# EAGLE design ESP32 VERSION 2 (EAGLE 9.1.3)
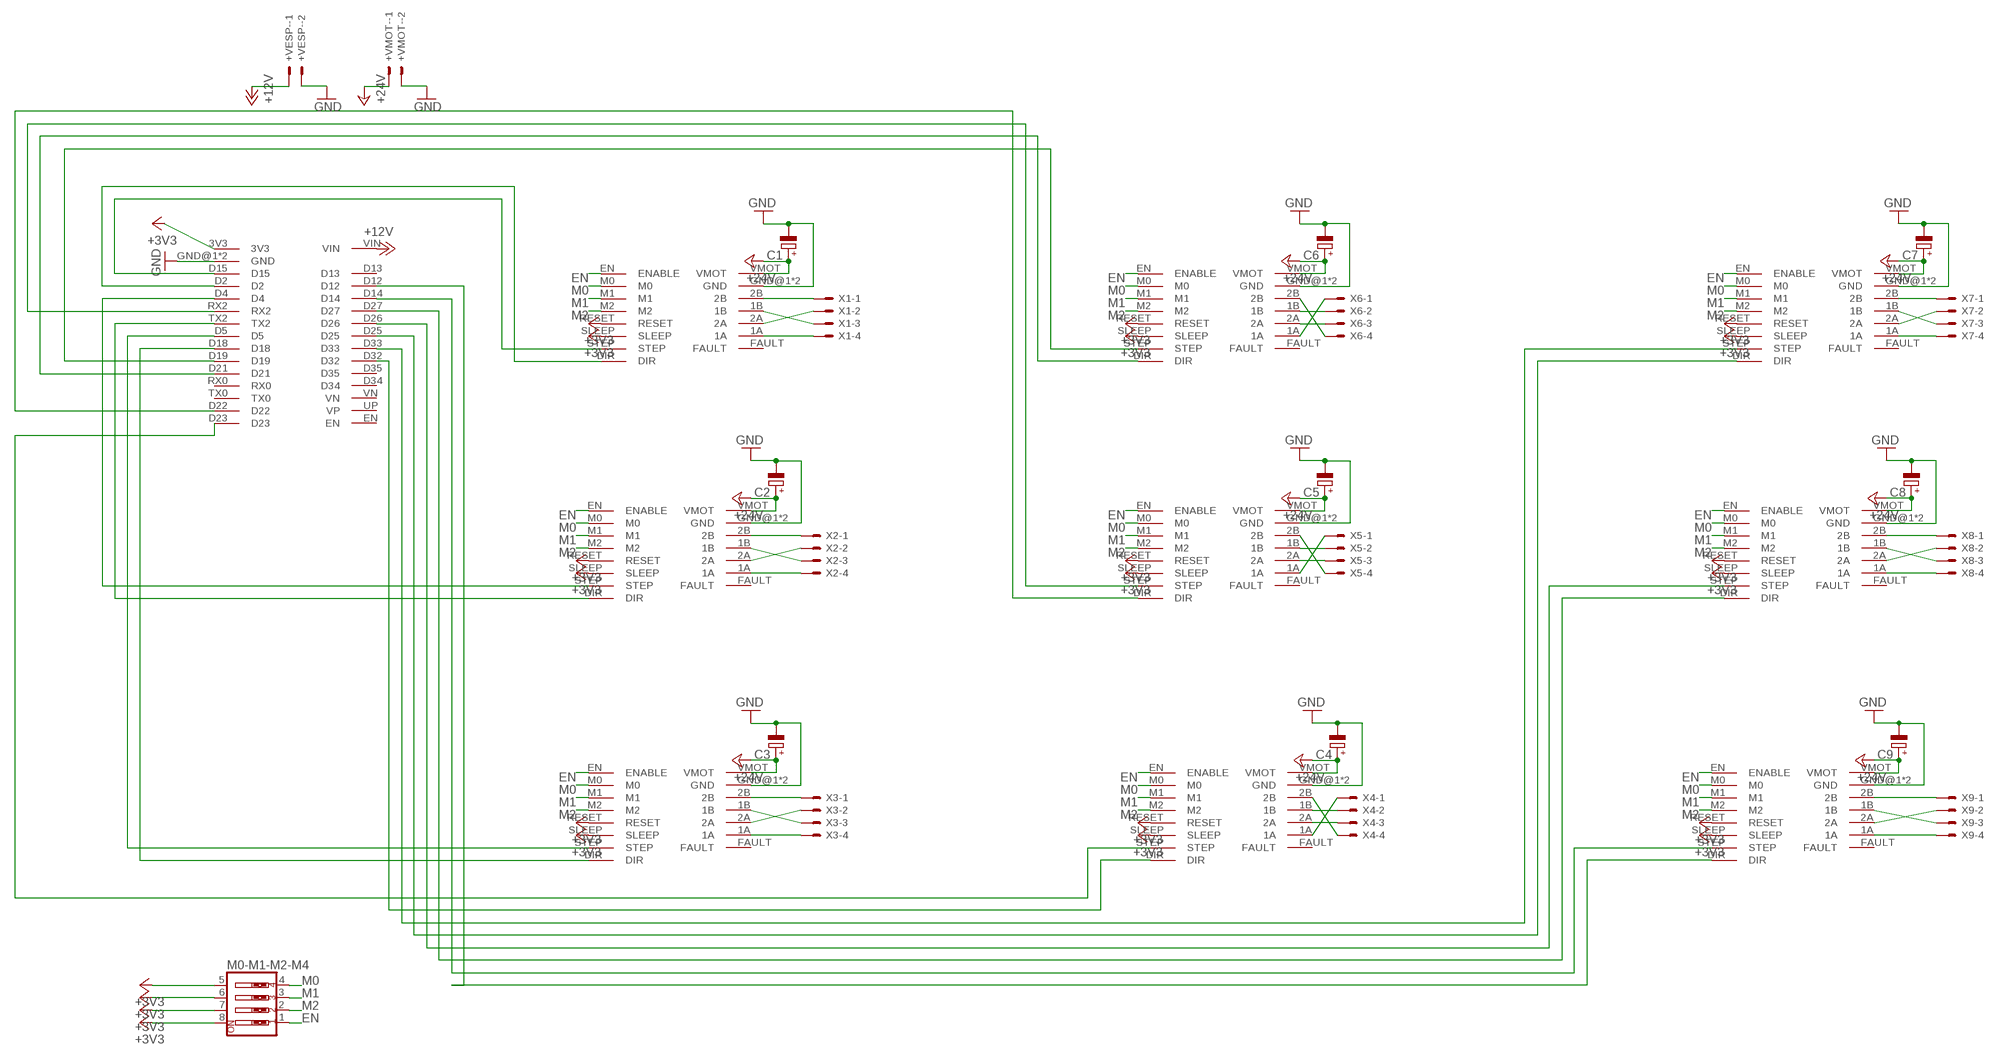
[diagram p0: schematic, sheet 1]

## Parts
+VESP-  22-23-2021  [22-23-2021]
+VMOT-  22-23-2021  [22-23-2021]
C1  CPOL-EUE3.5-8  [E3,5-8]
C2  CPOL-EUE3.5-8  [E3,5-8]
C3  CPOL-EUE3.5-8  [E3,5-8]
C4  CPOL-EUE3.5-8  [E3,5-8]
C5  CPOL-EUE3.5-8  [E3,5-8]
C6  CPOL-EUE3.5-8  [E3,5-8]
C7  CPOL-EUE3.5-8  [E3,5-8]
C8  CPOL-EUE3.5-8  [E3,5-8]
C9  CPOL-EUE3.5-8  [E3,5-8]
M0-M1-M2-M4  SW_DIP-4  [EDG-04]
U$1  DRV8825  [DRV8825]
U$2  DRV8825  [DRV8825]
U$3  STEPPER 0  DRV8825  [DRV8825]
U$4  DRV8825  [DRV8825]
U$5  DRV8825  [DRV8825]
U$6  DRV8825  [DRV8825]
U$7  DRV8825  [DRV8825]
U$8  DRV8825  [DRV8825]
U$9  DRV8825  [DRV8825]
U$10  ESP32  [ESP32]
X1  22-23-2041  [22-23-2041]
X2  22-23-2041  [22-23-2041]
X3  22-23-2041  [22-23-2041]
X4  22-23-2041  [22-23-2041]
X5  22-23-2041  [22-23-2041]
X6  22-23-2041  [22-23-2041]
X7  22-23-2041  [22-23-2041]
X8  22-23-2041  [22-23-2041]
X9  22-23-2041  [22-23-2041]

## Nets
+3V3: M0-M1-M2-M4.5 M0-M1-M2-M4.6 M0-M1-M2-M4.7 M0-M1-M2-M4.8 U$1.RESET U$1.SLEEP U$2.RESET U$2.SLEEP U$3.RESET U$3.SLEEP U$4.RESET U$4.SLEEP U$5.RESET U$5.SLEEP U$6.RESET U$6.SLEEP U$7.RESET U$7.SLEEP U$8.RESET U$8.SLEEP U$9.RESET U$9.SLEEP U$10.3V3
+12V: +VESP-.1 U$10.VIN
+24V: +VMOT-.1 C1.+ C2.+ C3.+ C4.+ C5.+ C6.+ C7.+ C8.+ C9.+ U$1.VMOT U$2.VMOT U$3.VMOT U$4.VMOT U$5.VMOT U$6.VMOT U$7.VMOT U$8.VMOT U$9.VMOT
EN [SIGNAL]: M0-M1-M2-M4.1 U$1.EN(ENABLE) U$2.EN(ENABLE) U$3.EN(ENABLE) U$4.EN(ENABLE) U$5.EN(ENABLE) U$6.EN(ENABLE) U$7.EN(ENABLE) U$8.EN(ENABLE) U$9.EN(ENABLE)
GND: +VESP-.2 +VMOT-.2 C1.- C2.- C3.- C4.- C5.- C6.- C7.- C8.- C9.- U$1.GND@1(GND) U$1.GND@2(GND) U$2.GND@1(GND) U$2.GND@2(GND) U$3.GND@1(GND) U$3.GND@2(GND) U$4.GND@1(GND) U$4.GND@2(GND) U$5.GND@1(GND) U$5.GND@2(GND) U$6.GND@1(GND) U$6.GND@2(GND) U$7.GND@1(GND) U$7.GND@2(GND) U$8.GND@1(GND) U$8.GND@2(GND) U$9.GND@1(GND) U$9.GND@2(GND) U$10.GND@1(GND) U$10.GND@2(GND)
M0 [SIGNAL]: M0-M1-M2-M4.4 U$1.M0 U$2.M0 U$3.M0 U$4.M0 U$5.M0 U$6.M0 U$7.M0 U$8.M0 U$9.M0
M1 [SIGNAL]: M0-M1-M2-M4.3 U$1.M1 U$2.M1 U$3.M1 U$4.M1 U$5.M1 U$6.M1 U$7.M1 U$8.M1 U$9.M1
M2 [SIGNAL]: M0-M1-M2-M4.2 U$1.M2 U$2.M2 U$3.M2 U$4.M2 U$5.M2 U$6.M2 U$7.M2 U$8.M2 U$9.M2
N$1: U$3.2B X1.1
N$2: U$9.1B X9.3
N$3: U$9.2A X9.2
N$4: U$3.1A X1.4
N$5 [SIGNAL]: U$3.STEP U$10.D15
N$6 [SIGNAL]: U$3.DIR U$10.D2
N$7: U$4.1A X6.1
N$8: U$4.2A X6.3
N$9: U$4.1B X6.2
N$10: U$4.2B X6.4
N$11 [SIGNAL]: U$2.STEP U$10.D4
N$12 [SIGNAL]: U$2.DIR U$10.TX2
N$13: U$7.2B X7.1
N$14: U$7.2A X7.2
N$15: U$7.1B X7.3
N$16: U$7.1A X7.4
N$17 [SIGNAL]: U$1.STEP U$10.D5
N$18: U$2.2B X2.1
N$19: U$8.2B X8.1
N$20: U$8.1B X8.3
N$21: U$8.2A X8.2
N$22: U$8.1A X8.4
N$23 [SIGNAL]: U$1.DIR U$10.D18
N$24: U$2.1B X2.3
N$25: U$9.2B X9.1
N$26: U$5.1B X5.2
N$27: U$5.2A X5.3
N$28: U$9.1A X9.4
N$29 [SIGNAL]: U$4.DIR U$10.D21
N$30: U$2.2A X2.2
N$31: U$5.1A X5.1
N$32: U$5.2B X5.4
N$33: U$6.1B X4.2
N$34: U$6.2A X4.3
N$35 [SIGNAL]: U$4.STEP U$10.D19
N$36 [SIGNAL]: U$5.STEP U$10.RX2
N$37: U$6.2B X4.4
N$38: U$6.1A X4.1
N$39: U$1.1B X3.3
N$40: U$1.2A X3.2
N$41 [SIGNAL]: U$5.DIR U$10.D22
N$42: U$2.1A X2.4
N$43: U$1.2B X3.1
N$44: U$3.1B X1.3
N$45: U$3.2A X1.2
N$46: U$1.1A X3.4
N$47 [SIGNAL]: U$6.STEP U$10.D23
N$48 [SIGNAL]: U$6.DIR U$10.D32
N$49 [SIGNAL]: U$7.STEP U$10.D33
N$50 [SIGNAL]: U$7.DIR U$10.D25
N$51: U$8.STEP U$10.D26
N$52 [SIGNAL]: U$8.DIR U$10.D27
N$53 [SIGNAL]: U$9.STEP U$10.D14
N$54 [SIGNAL]: U$9.DIR U$10.D12
Unconnected: U$1.FAULT U$2.FAULT U$3.FAULT U$4.FAULT U$5.FAULT U$6.FAULT U$7.FAULT U$8.FAULT U$9.FAULT U$10.D13 U$10.D34 U$10.D35 U$10.EN U$10.RX0 U$10.TX0 U$10.UP(VP) U$10.VN

## Library data of the parts
+VESP- +VMOT- = con-molex:22-23-2021: .100" (2.54mm) Center Header - 2 Pin; MF: MOLEX; MPN: 22-23-2021; OC_FARNELL: 1462926; OC_NEWARK: 25C3832
C1-C9 = resistor:CPOL-EU: POLARIZED CAPACITOR, European symbol
M0-M1-M2-M4 = special:SW_DIP-4: DIP SWITCH
U$1-U$9 = DRV8825:DRV8825
U$10 = ESP32:ESP32
X1-X9 = con-molex:22-23-2041: .100" (2.54mm) Center Header - 4 Pin; MF: MOLEX; MPN: 22-23-2041; OC_FARNELL: 1462920; OC_NEWARK: 38C0355

## Net classes
0 POWER: width 0.305 mm, clearance 0.152 mm
1 SIGNAL: width 0.152 mm, clearance 0.152 mm

## Board
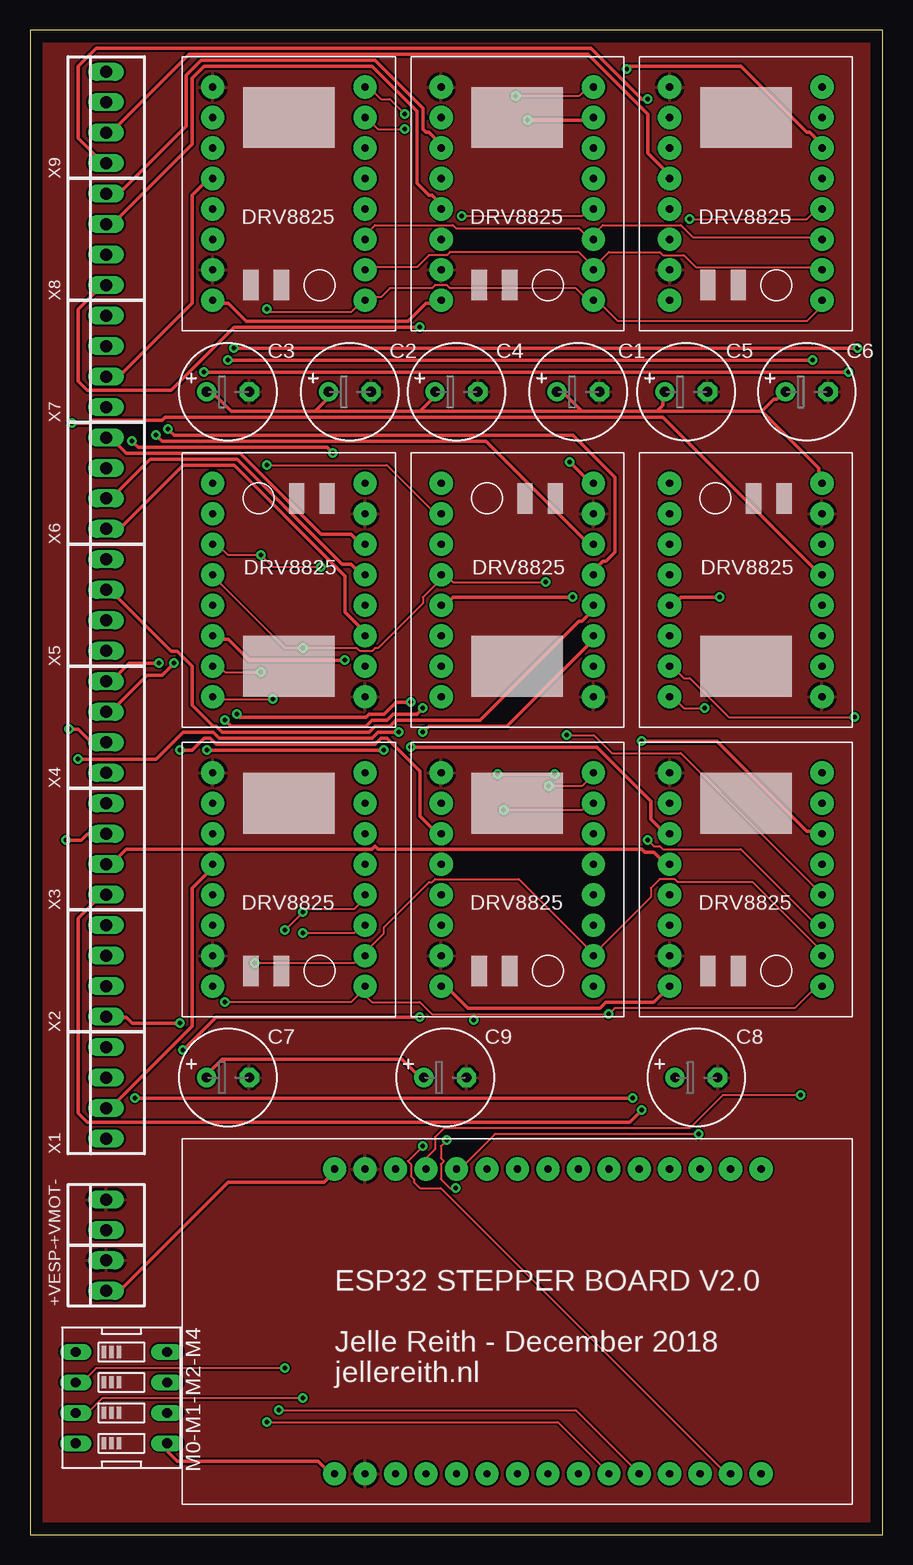
[diagram p1: board, top side]
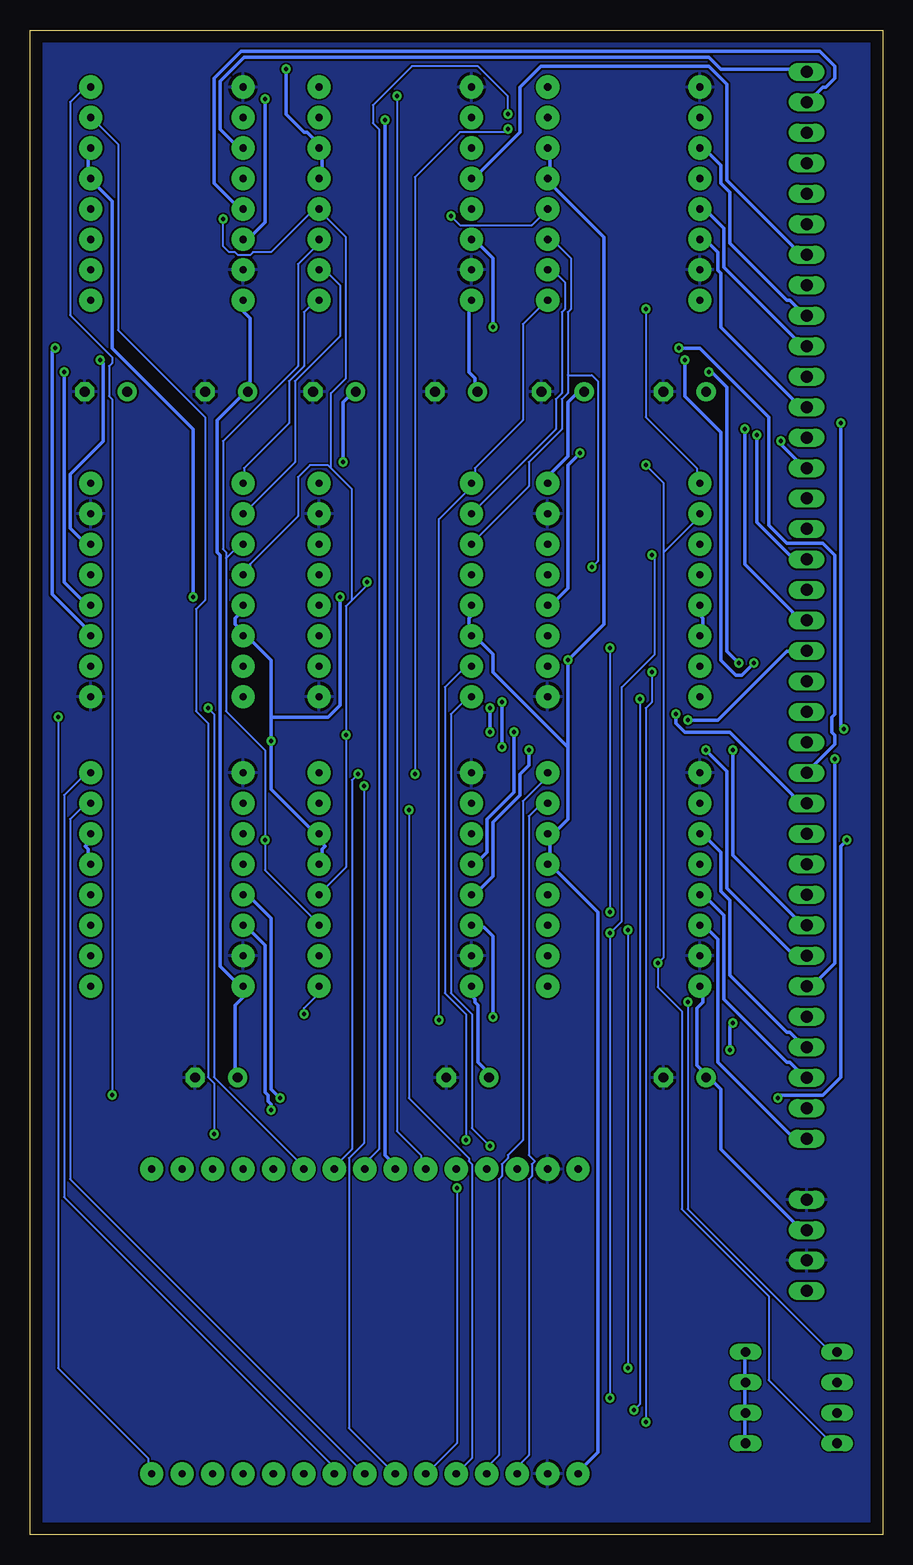
[diagram p2: board, bottom side, seen from below]

Size 71.1 x 125.4 mm. Coordinates in mm from the lower left corner, seen from the top.
Outline: 0,0 71.1,0 71.1,125.4 0,125.4 0,0
Copper layers (1*16): Top 0.035mm / dielectric 1.5mm / Bottom 0.035mm
Design rules "default *": minimum track width 6mil, minimum drill 0.35mm, track to track 6mil, track to pad 6mil, pad to pad 6mil, via to via 12mil, smd to smd 6mil, copper to edge 40mil, drill to drill 6mil, minimum pad ring 10mil, minimum via ring 8mil, stop-mask expansion 4mil, vias tented up to drill 0mil, thermal gap 10mil

### Footprints (pad centres in the part's own frame; a part is rotated, then mirrored left to right if it is on the bottom)
22-23-2021 = drill 1 long: 1 -1.27,0; 2 1.27,0
E3,5-8 = drill 0.813 pad 1.6: + -1.778,0 | drill 0.813 pad 1.6 octagon: - 1.778,0
EDG-04 = drill 0.813 long: 1 -3.81,-3.81; 2 -1.27,-3.81; 3 1.27,-3.81; 4 3.81,-3.81; 5 3.81,3.81; 6 1.27,3.81; 7 -1.27,3.81; 8 -3.81,3.81
DRV8825 = drill 0.6 pad 1.93: 1A 12.7,0; 1B 7.62,0; 2A 10.16,0; 2B 5.08,0; DIR 17.78,-12.7; EN 0,-12.7; FAULT 15.24,0; GND@1 17.78,0; GND@2 2.54,0; M0 2.54,-12.7; M1 5.08,-12.7; M2 7.62,-12.7; RESET 10.16,-12.7; SLEEP 12.7,-12.7; STEP 15.24,-12.7; VMOT 0,0
ESP32 = drill 0.6 pad 1.93: 3V3 0,-25.4; D2 7.62,-25.4; D4 10.16,-25.4; D5 17.78,-25.4; D12 7.62,0; D13 5.08,0; D14 10.16,0; D15 5.08,-25.4; D18 20.32,-25.4; D19 22.86,-25.4; D21 25.4,-25.4; D22 33.02,-25.4; D23 35.56,-25.4; D25 17.78,0; D26 15.24,0; D27 12.7,0; D32 22.86,0; D33 20.32,0; D34 27.94,0; D35 25.4,0; EN 35.56,0; GND@1 2.54,0; GND@2 2.54,-25.4; RX0 27.94,-25.4; RX2 12.7,-25.4; TX0 30.48,-25.4; TX2 15.24,-25.4; UP 33.02,0; VIN 0,0; VN 30.48,0
22-23-2041 = drill 1 long: 1 -3.81,0; 2 -1.27,0; 3 1.27,0; 4 3.81,0

### Placement (x,y rotation side)
+VESP-  6.35,21.59 90 top
+VMOT-  6.35,26.67 90 top
C1  45.72,95.25 0 top
C2  26.67,95.25 0 top
C3  16.51,95.25 0 top
C4  35.56,95.25 0 top
C5  54.72,95.25 0 top
C6  64.77,95.25 0 top
C7  16.51,38.1 0 top
C8  55.56,38.1 0 top
C9  34.61,38.1 0 top
M0-M1-M2-M4  7.62,11.43 270 top
U$1  53.34,45.72 90 top
U$2  34.29,45.72 90 top
U$3  15.24,45.72 90 top
U$4  27.94,87.63 270 top
U$5  46.99,87.63 270 top
U$6  66.04,87.63 270 top
U$7  15.24,102.87 90 top
U$8  34.29,102.87 90 top
U$9  53.34,102.87 90 top
U$10  25.4,30.48 0 top
X1  6.35,36.83 90 top
X2  6.35,46.99 90 top
X3  6.35,57.15 90 top
X4  6.35,67.31 90 top
X5  6.35,77.47 90 top
X6  6.35,87.63 90 top
X7  6.35,97.79 90 top
X8  6.35,107.95 90 top
X9  6.35,118.11 90 top

### Tracks (layer width: path | path; a pad name or v marks a point on that pad's centre or on a via)
+3V3  (via drill 0.35)
  Top 0.305: v49.75,122.15 50,122.4 59.25,122.4 64.75,116.9 65,116.9 66.25,115.65 U$9.SLEEP | v51,66.15 57.25,66.15 64.75,58.65 66,58.65 U$1.SLEEP | v57.5,78.15 54.25,78.15 53.75,77.65 53.5,77.65 U$6.RESET | U$10.3V3 25.25,5.15 25,5.4 24.75,5.4 24,6.15 12.25,6.15 11.5,6.9 11.5,7.4 M0-M1-M2-M4.5 | v26.25,72.9 18.25,72.9 16.5,74.65 15.5,74.65 15.25,74.9 U$4.SLEEP | v45.25,78.15 35.25,78.15 34.75,77.65 34.5,77.65 U$5.RESET
  Bottom 0.305: U$8.RESET 46.75,113.15 46.75,115.4 U$8.SLEEP 47,115.65 47.5,116.15 47.5,116.4 48,116.9 48.25,116.9 49.75,118.4 v49.75,122.15 | U$9.SLEEP 66.25,115.4 66.25,113.15 U$9.RESET 66,112.9 64.25,111.15 64.25,98.9 57.5,92.15 v57.5,78.15 | U$1.RESET 66.25,55.9 66.25,57.15 66.5,57.4 66.25,57.65 66.25,58.4 U$1.SLEEP | U$2.RESET 46.75,55.9 46.75,57.15 46.5,57.4 46.75,57.65 46.75,58.4 U$2.SLEEP 47,58.65 47.75,58.65 47.75,58.9 51,62.15 v51,66.15 51,68.15 | U$6.RESET 53.5,77.4 53.5,76.9 54,76.4 54,75.9 53.75,75.65 53.75,75.4 53.5,75.15 U$6.SLEEP 53.25,75.15 51,72.9 51,68.15 | M0-M1-M2-M4.5 11.5,7.65 11.5,10.15 M0-M1-M2-M4.6 11.5,10.4 11.5,12.65 M0-M1-M2-M4.7 11.5,12.9 11.5,15.15 M0-M1-M2-M4.8 | U$7.SLEEP 27.75,115.4 27.75,113.15 U$7.RESET 27.75,112.9 27.5,112.65 27.5,112.4 23.25,108.15 23.25,75.9 v26.25,72.9 26.25,65.65 | U$4.SLEEP 15,75.15 15,76.4 15.25,76.65 15.25,77.4 U$4.RESET | 27.75,55.9 27.75,58.4 U$3.SLEEP 27.75,58.65 27.25,58.65 26.25,59.65 26.25,65.65 | 27.75,55.9 U$3.RESET 27.75,55.9 | U$5.RESET 34.25,77.4 34.25,76.65 34.5,76.4 34.5,75.15 U$5.SLEEP 34.25,75.15 32.5,73.4 32.5,71.9 26.25,65.65 | 27.75,55.9 23.75,51.9 23.75,6.9 25,5.65 25,5.4 25.25,5.15 U$10.3V3 | 51,68.15 46.25,68.15 45.25,69.15 v45.25,78.15
+12V
  Top 0.305: +VESP-.1 6.5,20.4 6.75,20.65 7.75,20.65 16.5,29.4 24.5,29.4 25.5,30.4 U$10.VIN
+24V  (via drill 0.35)
  Top 0.305: U$1.VMOT 53.25,45.65 52,44.4 48,44.4 47.5,43.9 36.5,43.9 34.75,45.65 34.5,45.65 U$2.VMOT | C9.+ 32.75,38.15 32.5,38.4 32.25,38.4 31,39.65 16,39.65 14.5,38.15 C7.+ | 23.75,93.65 16.75,93.65 15.5,94.9 15,94.9 14.75,95.15 C3.+ | 23.75,93.65 24.75,94.65 24.75,95.15 C2.+ | U$7.VMOT 15.25,102.65 16.5,102.65 18,101.15 31.5,101.15 33,102.65 34.25,102.65 U$8.VMOT | 32.5,93.65 23.75,93.65 | 32.5,93.65 34,95.15 C4.+ | 46,93.65 44.5,95.15 44,95.15 C1.+ | 52.25,93.65 46,93.65 | 52.25,93.65 52.75,94.15 52.75,95.15 C5.+ | 61,93.65 62,94.65 62.25,94.65 62.75,95.15 C6.+ | 52.25,93.65 61,93.65 | v45,89.4 46.75,87.65 U$5.VMOT | 61,93.65 65.75,88.9 65.75,88.65 66,88.4 66,87.65 U$6.VMOT | 46,93.65 32.5,93.65
  Bottom 0.305: C8.+ 54,38.15 54,44.15 53.25,44.9 53.25,45.65 U$1.VMOT 53.5,45.9 54,45.9 54,46.15 55.25,47.4 55.25,81.65 55.5,81.9 55.5,92.9 53,95.4 | C9.+ 33,38.15 33,38.65 33.75,39.4 33.75,44.15 34,44.4 34,44.65 34.25,44.9 34.25,45.65 U$2.VMOT | +VMOT-.1 6.5,25.4 7,25.9 7.25,25.9 13.5,32.15 13.5,37.15 14.5,38.15 C7.+ 14.75,38.15 14.75,38.4 15.5,39.15 15.5,43.9 15,44.4 15,45.65 U$3.VMOT | U$4.VMOT 27.75,87.65 27.75,88.4 26.25,89.9 26.25,94.4 25.5,95.15 25,95.15 C2.+ | C4.+ 34,95.4 34,96.4 34.5,96.9 34.5,102.65 U$8.VMOT | v45,89.4 45,94.4 44,95.4 C1.+ | 53,95.4 53,95.9 52.75,96.15 52.75,101.4 53.25,101.9 53.25,102.65 U$9.VMOT | 53,95.4 C5.+ 53,95.4
EN  (via drill 0.35)
  Top 0.152: v19.75,102.15 20,101.9 26.75,101.9 27.5,102.65 27.75,102.65 U$7.EN 28,102.9 28.25,103.15 29.25,103.15 30,103.9 33.5,103.9 33.75,104.15 34.75,104.15 35,103.9 45.5,103.9 46.5,102.9 46.75,102.9 U$8.EN 47,102.65 47.25,102.4 47.75,102.4 49,101.15 64.75,101.15 66.25,102.65 U$9.EN | U$1.EN 66,45.65 65.5,45.65 63.75,43.9 48.75,43.9 v48.25,43.4 37,43.4 | v16.25,44.4 26.75,44.4 27.5,45.15 | 27.5,45.15 28,45.65 U$3.EN 27.5,45.15 | 37,43.4 33.5,43.4 32.5,44.4 28.5,44.4 27.75,45.15 27.5,45.15 | 37,43.4 v37,42.9
  Bottom 0.152: v19.75,102.15 19.75,93.15 15.5,88.9 15.5,87.9 15.25,87.65 U$4.EN | U$7.EN 28,102.9 30,100.9 30,92.9 34,88.9 34,87.9 34.25,87.65 U$5.EN 34.5,87.4 34.75,87.15 34.75,86.9 37,84.65 v37,42.9 | U$6.EN 53.25,87.65 53.25,88.9 49.5,92.65 49.5,96.15 48.25,97.4 48.25,101.9 47.5,102.65 47,102.65 U$8.EN | v48.25,43.4 48.25,43.9 47.25,44.9 47.25,45.4 47,45.65 U$2.EN | v16.25,44.4 16.25,27.15 4.75,15.65 4.75,15.4 4,15.4 M0-M1-M2-M4.1
GND
  pour Top: 0,0 71.1,0 71.1,125.4 0,125.4
  pour Bottom: 0,0 71.1,0 71.1,125.4 0,125.4
M0  (via drill 0.35)
  Top 0.152: 46.5,106.15 47,105.65 U$8.M0 46.5,106.15 | 46.5,106.15 45.75,106.9 35,106.9 34.75,106.65 33.25,106.65 32.25,105.65 28,105.65 U$7.M0 | 46.5,106.15 47.5,106.15 48.25,106.9 52.5,106.9 52.75,106.65 54.5,106.65 55.5,105.65 66,105.65 U$9.M0 | 47.5,48.9 51.75,53.15 51.75,53.9 52.5,54.65 53.75,54.65 54,54.4 60.25,54.4 66.25,48.4 U$1.M0 | 47.5,48.9 47,48.4 U$2.M0 47.5,48.9 | v18.75,47.65 27,47.65 27.5,48.15 27.75,48.15 U$3.M0 27.75,48.4 29.5,50.15 29.5,50.65 33.25,54.4 33.5,54.4 33.75,54.65 40.75,54.65 46.5,48.9 47.5,48.9 | v19.75,89.15 29.75,89.15 33.5,85.4 34,85.4 34.25,85.15 U$5.M0
  Bottom 0.152: U$5.M0 34.25,85.15 27.25,92.15 27.25,94.65 26.75,95.15 26.75,101.9 26.5,102.15 26.5,104.4 27.75,105.65 U$7.M0 | U$6.M0 53.25,85.15 49,89.4 49,96.15 45.25,99.9 45.25,104.15 46.75,105.65 U$8.M0 | M0-M1-M2-M4.4 4,7.65 4.5,8.15 4.75,8.15 9.5,12.9 9.5,19.9 16.75,27.15 16.75,43.65 18.75,45.65 v18.75,47.65 18.25,48.15 18.25,81.9 | 18.25,81.9 15.25,84.9 U$4.M0 | v19.75,89.15 18.25,87.65 18.25,81.9
M1  (via drill 0.35)
  Top 0.152: v22.75,11.4 6,11.4 5,10.4 4,10.4 M0-M1-M2-M4.3 | v22.75,50.15 27,50.15 27.5,50.65 27.75,50.65 U$3.M1 | U$4.M1 15.25,82.4 15.5,82.15 16,82.15 16.5,81.65 v19.25,81.65 20.25,80.65 v24.25,80.65 | v51.5,57.9 52,57.4 52.5,57.4 52.75,57.15 59.25,57.15 65.25,51.15 65.75,51.15 66,50.9 U$1.M1 | 46.5,108.4 46.75,108.15 U$8.M1 46.5,108.4 | 46.5,108.4 46.25,108.4 45.75,108.9 35.5,108.9 35.25,109.15 28.75,109.15 27.75,108.15 U$7.M1 | 46.5,108.4 47,108.4 47.75,109.15 54.25,109.15 55.25,108.15 66,108.15 U$9.M1
  Bottom 0.152: v22.75,11.4 v22.75,50.15 21.75,51.15 21.75,70.65 19,73.4 19,81.4 v19.25,81.65 | 54.75,81.4 54.75,68.65 51.5,65.4 v51.5,57.9 51.5,55.4 47,50.9 U$2.M1 | 54.75,81.4 53.5,82.65 U$6.M1 | 26.25,96.65 26.25,101.9 26,102.15 26,106.4 27.75,108.15 U$7.M1 | 26.25,96.65 26.25,95.15 26.75,94.65 26.75,92.15 29.5,89.4 29.5,87.4 34.25,82.65 U$5.M1 | 54.75,81.4 54.75,81.9 55,82.15 55,91.15 48.75,97.4 48.75,105.9 47.5,107.15 47,107.15 47,107.9 U$8.M1 | v24.25,80.65 23.75,81.15 23.75,96.15 24.25,96.65 26.25,96.65
M2  (via drill 0.35)
  Top 0.152: v21.25,13.9 5.5,13.9 4.75,13.15 4.25,13.15 4,12.9 M0-M1-M2-M4.2 | v21.25,50.4 v22.75,51.9 23,52.15 27,52.15 28,53.15 U$3.M2 | v36,109.9 46,109.9 46.5,110.4 46.75,110.4 U$8.M2 | v55,109.65 64.75,109.65 65.25,110.15 65.75,110.15 66,110.4 U$9.M2 | v43,79.4 35.25,79.4 35,79.65 | 35,79.65 34.75,79.9 34.5,79.9 U$5.M2 35,79.65 | 35,79.65 34.25,79.65 32.75,78.15 32.75,77.65 29,73.9 28.75,73.9 28.5,73.65 27.5,73.65 27.25,73.9 v22.75,73.9 21.25,73.9 15.25,79.9 U$4.M2 | v44.75,66.65 47,66.65 48.5,65.15 54.25,65.15 66,53.4 U$1.M2
  Bottom 0.152: v21.25,50.4 v21.25,13.9 | v36,109.9 35.25,109.15 29.25,109.15 28,110.4 U$7.M2 | v55,109.65 55,107.4 54.5,106.9 54,106.9 53.75,106.65 52.75,106.65 52.5,106.9 51,106.9 47.5,110.4 47,110.4 U$8.M2 46.75,110.4 46.5,110.15 46.5,109.9 44.75,108.15 44.75,96.4 46,95.15 46,88.9 | 44.25,77.9 43,79.15 v43,79.4 | 44.25,77.9 44.75,77.4 v44.75,66.65 44.75,55.65 46.5,53.9 46.5,53.65 46.75,53.4 U$2.M2 | 46,88.9 44.25,87.15 44.25,77.9 | 46,88.9 46.25,89.15 47.75,89.15 48.75,88.15 48.75,84.9 52.75,80.9 52.75,80.65 53.25,80.15 U$6.M2 | v22.75,73.9 v22.75,51.9
N$1
  Bottom 0.305: X1.1 6.5,33.15 7.5,33.15 13.75,39.4 13.75,49.65 15,50.9 U$3.2B
N$2
  Bottom 0.305: X9.3 6.25,119.4 5,120.65 4.75,120.65 4,121.4 4,122.4 5.25,123.65 53.5,123.65 55.75,121.4 55.75,112.65 53.5,110.4 U$9.1B
N$3
  Top 0.305: X9.2 6.5,116.9 7,117.4 7.25,117.4 13.25,123.4 46.5,123.4 51.5,118.4 51.5,115.15 53.5,113.15 U$9.2A
N$4
  Bottom 0.305: X1.4 6.5,40.65 7.75,41.9 8,41.9 12.75,46.65 12.75,52.9 13.5,53.65 13.5,56.9 15,58.4 U$3.1A
N$5
  Bottom 0.152: U$10.D15 30.25,5.15 30.25,5.9 29.5,6.65 29.5,29.65 29.25,29.9 29.25,30.9 29,31.15 29.5,31.65 29.5,59.9 28.5,60.9 28,60.9 U$3.STEP
N$6
  Bottom 0.152: U$10.D2 33,5.15 32.75,5.4 32.75,5.9 32,6.65 32,29.65 31.75,29.9 31.75,30.9 31.25,31.4 31.25,31.65 30,32.9 30,61.15 28,63.15 28,63.4 U$3.DIR
N$7
  Top 0.305: X6.1 6.5,83.9 6.75,84.15 7.75,84.15 12.75,89.15 17,89.15 26.25,79.9 26.25,76.9 28,75.15 U$4.1A
N$8  (via drill 0.35)
  Top 0.305: v8.5,91.15 9,90.65 24.75,90.65 v25.25,90.15
  Bottom 0.305: v8.5,91.15 8.5,90.9 6.5,88.9 X6.3 | v25.25,90.15 26.25,89.15 26.25,78.9 27.75,77.4 U$4.2A
N$9
  Top 0.305: X6.2 6.5,86.4 7,86.9 7.25,86.9 10,89.65 17.25,89.65 26,80.9 26.75,80.9 27.5,80.15 27.75,80.15 U$4.1B
N$10
  Top 0.305: X6.4 6.5,91.4 7,90.9 7.25,90.9 8,90.15 17.5,90.15 24.25,83.4 26.75,83.4 27.5,82.65 27.75,82.65 U$4.2B
N$11  (via drill 0.35)
  Top 0.152: v39.5,60.4 46,60.4 46.5,60.9 46.75,60.9 U$2.STEP
  Bottom 0.152: v39.5,60.4 39.5,36.4 34.5,31.4 34.5,31.15 34.25,30.9 34.25,6.4 35.5,5.15 U$10.D4
N$12  (via drill 0.35)
  Top 0.152: v43.25,62.4 46,62.4 47,63.4 U$2.DIR
  Bottom 0.152: v43.25,62.4 43.25,32.65 44.5,31.4 44.5,8.9 40.75,5.15 U$10.TX2
N$13
  Bottom 0.305: X7.1 6.5,94.15 7.5,94.15 7.5,94.65 13.5,100.65 13.5,105.15 13.75,105.4 13.75,106.9 15,108.15 U$7.2B
N$14
  Top 0.305: X7.2 6.5,96.65 6.75,96.9 7.75,96.9 13.5,102.65 13.5,111.65 14.75,112.9 15,112.9 U$7.2A
N$15
  Bottom 0.305: X7.3 6.5,99.15 7,99.65 7.25,99.65 13.25,105.65 13.25,108.9 15,110.65 U$7.1B
N$16
  Bottom 0.305: X7.4 6.5,101.65 7.75,102.9 8,102.9 12.75,107.65 12.75,111.9 13.5,112.65 13.5,114.15 15,115.65 U$7.1A
N$17
  Bottom 0.152: U$10.D5 43.25,5.15 67.75,29.65 67.75,59.65 66.25,61.15 U$1.STEP
N$18  (via drill 0.35)
  Top 0.305: v12.5,42.65 8.5,42.65 8,43.15 6.5,43.15 X2.1 | v12.75,40.4 15.5,43.15 v32.5,43.15
  Bottom 0.305: v12.5,42.65 12.75,42.4 v12.75,40.4 | v32.5,43.15 32.5,49.9 33.25,50.65 34.25,50.65 U$2.2B
N$19  (via drill 0.35)
  Top 0.305: v32.5,100.65 17,100.65 11.75,95.4 4.75,95.4 4,96.15 4,102.15 5.5,103.65 6,103.65 6.25,103.9 X8.1
  Bottom 0.305: v32.5,100.65 32.5,106.4 34.25,108.15 U$8.2B
N$20
  Top 0.305: X8.3 6.5,109.4 6.75,109.65 7.25,109.65 13.5,115.9 13.5,121.4 14.5,122.4 28.5,122.4 32.25,118.65 32.25,112.65 33.25,111.65 33.5,111.65 34.5,110.65 U$8.1B
N$21
  Bottom 0.305: X8.2 6.5,106.9 7.25,106.9 7.25,107.15 13,112.9 13,120.9 14.5,122.4 28.5,122.4 30.25,120.65 30.25,116.9 34.25,112.9 U$8.2A
N$22
  Top 0.305: X8.4 6.5,111.9 6.75,112.15 7.75,112.15 13,117.4 13,121.65 14.25,122.9 28.75,122.9 32.75,118.9 32.75,117.15 33,116.9 33.25,116.9 34.5,115.65 U$8.1A
N$23
  Bottom 0.152: U$10.D18 45.75,5.15 46,5.4 46,5.9 68.25,28.15 68.25,61.65 66.25,63.65 U$1.DIR
N$24  (via drill 0.35)
  Top 0.305: v29.5,65.4 v14.75,65.4
  Bottom 0.305: v14.75,65.4 13,63.65 13,53.9 7.5,48.4 6.5,48.4 X2.3 | v29.5,65.4 29.5,64.15 30.25,63.4 30.25,61.65 32.5,59.4 32.5,54.9 34.25,53.15 U$2.1B
N$25  (via drill 0.35)
  Top 0.305: v51.5,119.65 51,119.65 46.75,123.9 5.5,123.9 4,122.4 4,116.4 5.5,114.9 5.75,114.9 6.25,114.4 X9.1
  Bottom 0.305: v51.5,119.65 51.5,109.4 52.5,108.4 53.25,108.4 53.25,108.15 U$9.2B
N$26  (via drill 0.35)
  Top 0.305: v11.5,92.15 12,91.65 45.25,91.65 48.75,88.15 48.75,81.9 48,81.15 47.75,81.15 46.75,80.15 U$5.1B
  Bottom 0.305: v11.5,92.15 11.5,80.9 7.5,76.9 7.5,76.4 6.5,76.4 X5.2
N$27
  Top 0.305: X5.3 6.5,78.65 7,78.15 7.25,78.15 11.75,73.65 12.25,73.65 13.5,72.4 13.5,69.15 15.25,67.4 15.5,67.4 16,66.9 28.25,66.9 28.75,67.4 30,67.4 30.5,67.9 37.5,67.9 45.75,76.15 46,76.15 46.75,76.9 46.75,77.4 U$5.2A
N$28
  Bottom 0.305: X9.4 6.5,122.15 13.5,122.15 14.5,123.15 53.25,123.15 55.25,121.15 55.25,117.15 53.5,115.4 U$9.1A
N$29  (via drill 0.35)
  Top 0.152: v20.75,10.4 45.5,10.4 50.75,5.15 U$10.D21 | v20.25,69.65 15.25,69.65 U$4.DIR
  Bottom 0.152: v20.75,10.4 20.25,10.9 v20.25,69.65
N$30  (via drill 0.35)
  Top 0.305: v4,64.65 10.5,64.65 12.75,66.9 15.25,66.9 15.75,66.4 28.5,66.4 29,66.9 v30.75,66.9
  Bottom 0.305: v4,64.65 4,47.65 5.25,46.4 5.25,45.9 6.25,45.9 X2.2 | v30.75,66.9 30.75,61.9 33,59.65 33,56.9 34.25,55.65 U$2.2A
N$31  (via drill 0.35)
  Top 0.305: v16.25,67.9 16.75,67.4 28,67.4 28.5,67.9 29.75,67.9 30.25,68.4 32.25,68.4 v32.75,68.9 | v32.75,66.9 33.25,67.4 39.75,67.4 46.75,74.4 46.75,74.9 U$5.1A
  Bottom 0.305: v16.25,67.9 13.75,67.9 8,73.65 6.5,73.65 X5.1 | v32.75,66.9 v32.75,68.9
N$32  (via drill 0.35)
  Top 0.305: v10.5,91.65 11,91.15 38,91.15 46.5,82.65 46.75,82.65 U$5.2B
  Bottom 0.305: v10.5,91.65 10.5,84.4 7.5,81.4 6.5,81.4 X5.4
N$33  (via drill 0.35)
  Top 0.305: v3.25,67.15 4,67.15 5,66.15 6.25,66.15 X4.2 | v3.5,92.65 5,92.65 5.25,92.9 11,92.9 11.25,93.15 52.75,93.15 65.75,80.15 66,80.15 U$6.1B
  Bottom 0.305: v3.25,67.15 3.5,67.4 v3.5,92.65
N$34  (via drill 0.35)
  Top 0.305: v12,72.65 11,71.65 9.75,71.65 7.25,69.15 7,69.15 6.5,68.65 X4.3 | v68.25,96.9 v14.5,96.9
  Bottom 0.305: v12,72.65 13,73.65 13,95.65 14.25,96.9 v14.5,96.9 | v68.25,96.9 68.25,79.4 66.25,77.4 U$6.2A
N$35  (via drill 0.35)
  Top 0.152: v19.75,9.4 44,9.4 48.25,5.15 U$10.D19 | v19.25,71.9 16.25,71.9 16,72.15 15.25,72.15 U$4.STEP
  Bottom 0.152: v19.75,9.4 19.75,68.9 19.25,69.4 v19.25,71.9
N$36  (via drill 0.35)
  Top 0.152: v35.5,28.9 35,28.9 34.25,29.65 34.25,30.9 34.5,31.15 34.25,31.4 34.25,32.4 v34.75,32.9
  Bottom 0.152: v35.5,28.9 35.5,7.65 38,5.15 U$10.RX2 | v34.75,32.9 34.75,43.4 36.5,45.15 36.5,70.65 35,72.15 34.5,72.15 U$5.STEP
N$37  (via drill 0.35)
  Top 0.305: v10.75,72.65 8.25,72.65 7.25,71.65 7,71.65 6.5,71.15 X4.4 | v65.25,97.9 v16.5,97.9
  Bottom 0.305: v10.75,72.65 11.75,71.65 12.25,71.65 13.5,72.9 13.5,91.9 16.5,94.9 v16.5,97.9 | v65.25,97.9 65,97.65 65,91.15 67.75,88.4 67.75,83.9 66.25,82.4 U$6.2B
N$38  (via drill 0.35)
  Top 0.305: v69,98.9 v17,98.9
  Bottom 0.305: v17,98.9 15.25,98.9 9.5,93.15 9.5,84.15 8,82.65 5,82.65 4,81.65 4,68.4 4.25,68.15 4.25,66.9 4,66.65 4,65.9 6.25,63.65 X4.1 | v69,98.9 69.25,98.65 69.25,78.4 66.25,75.4 66.25,75.15 U$6.1A
N$39  (via drill 0.35)
  Top 0.305: v3,57.9 4.25,57.9 4.75,58.4 6.25,58.4 X3.3 | v50.25,36.4 v8.75,36.4
  Bottom 0.305: v3,57.9 3.5,57.4 3.5,38.15 5,36.65 8.5,36.65 v8.75,36.4 | v50.25,36.4 51,37.15 51,51.4 52.5,52.9 53.25,52.9 53.25,53.15 U$1.1B
N$40
  Top 0.305: X3.2 6.5,55.9 7,56.4 7.25,56.4 8,57.15 28.5,57.15 28.75,57.4 29,57.15 51,57.15 51.25,56.9 52,56.9 53,55.9 53.25,55.9 U$1.2A
N$41  (via drill 0.35)
  Top 0.152: v32.75,32.4 31.5,31.15 31.75,30.9 31.75,29.9 32,29.65 32,29.4 32.5,28.9 34.25,28.9 57.5,5.65 57.75,5.65 58.25,5.15 U$10.D22
  Bottom 0.152: v32.75,32.4 34.25,33.9 34.25,43.4 36,45.15 36,68.4 34.5,69.9 U$5.DIR
N$42  (via drill 0.35)
  Top 0.305: v12.5,65.4 13.5,65.4 14.5,66.4 15,66.4 15.5,65.9 28.75,65.9 29.25,66.4 29.75,66.4 32.5,63.65 32.5,59.9 33.75,58.65 34.25,58.65 U$2.1A
  Bottom 0.305: v12.5,65.4 12.5,56.65 7.25,51.4 7,51.4 6.5,50.9 X2.4
N$43  (via drill 0.35)
  Top 0.305: v51,35.4 50,34.4 4.75,34.4 4,35.15 4,51.4 5.5,52.9 6,52.9 6.25,53.15 X3.1
  Bottom 0.305: v51,35.4 51,35.9 51.25,36.15 51.25,36.65 51.5,36.9 51.5,49.15 53.25,50.9 U$1.2B
N$44
  Bottom 0.305: X1.3 6.5,38.15 7.75,39.4 8,39.4 13.25,44.65 13.25,51.65 15,53.4 U$3.1B
N$45
  Top 0.305: X1.2 6.5,35.65 7,36.15 7.25,36.15 13.5,42.4 13.5,53.9 15.25,55.65 U$3.2A
N$46  (via drill 0.35)
  Top 0.305: v17.25,68.4 17.5,68.15 28,68.15 28.25,68.4 29.5,68.4 30.5,69.4 v31.75,69.4 | v31.75,65.65 47.25,65.65 51.75,61.15 51.75,59.65 52.75,58.65 53.25,58.65 U$1.1A
  Bottom 0.305: v17.25,68.4 17.25,67.65 16.5,66.9 12.75,66.9 7.5,61.65 7.5,61.15 6.5,61.15 X3.4 | v31.75,65.65 v31.75,69.4
N$47  (via drill 0.35)
  Top 0.152: v68.75,68.15 58.25,68.15 55,71.4 54.5,71.4 53.75,72.15 53.5,72.15 U$6.STEP
  Bottom 0.152: v68.75,68.15 68.75,13.9 61.25,6.4 61.25,5.4 61,5.15 U$10.D23
N$48  (via drill 0.35)
  Top 0.152: v56.25,68.9 54.5,68.9 53.75,69.65 53.5,69.65 U$6.DIR
  Bottom 0.152: v56.25,68.9 55.75,68.4 55.75,38.15 48.75,31.15 48.75,30.9 48.5,30.65 U$10.D32
N$49  (via drill 0.35)
  Top 0.152: v39,63.4 v43.75,63.4 | v31.25,117.15 29,117.15 28.25,117.9 28,117.9 U$7.STEP
  Bottom 0.152: v43.75,63.4 44.25,62.9 44.25,32.15 45.25,31.15 45.25,30.9 45.5,30.65 U$10.D33 | v39,63.4 39,113.15 35.25,116.9 31.5,116.9 v31.25,117.15
N$50  (via drill 0.35)
  Top 0.152: v31.25,118.4 30,119.65 29.25,119.65 28.25,120.65 28,120.65 U$7.DIR
  Bottom 0.152: v31.25,118.4 31.25,119.9 33.75,122.4 39.25,122.4 42.5,119.15 42.5,117.65 42,117.15 42,32.15 42.75,31.4 42.75,30.9 43,30.65 U$10.D25
N$51  (via drill 0.35)
  Top 0.305: v41.5,117.9 46.75,117.9 U$8.STEP
  Bottom 0.305: v41.5,117.9 41.5,31.65 41,31.15 41,30.9 40.75,30.65 U$10.D26
N$52  (via drill 0.35)
  Top 0.152: v40.5,119.9 45.75,119.9 46.5,120.65 46.75,120.65 U$8.DIR
  Bottom 0.152: v40.5,119.9 40.5,33.65 38.5,31.65 38.5,30.9 38.25,30.65 U$10.D27
N$53  (via drill 0.35)
  Top 0.152: v55.75,33.4 38.75,33.4 36.25,30.9 36,30.9 35.75,30.65 U$10.D14
  Bottom 0.152: v55.75,33.4 55.75,37.65 56.25,38.15 56.25,67.65 57.25,68.65 57.25,77.15 56.5,77.9 56.5,93.15 63.75,100.4 63.75,115.9 66,118.15 U$9.STEP
N$54  (via drill 0.35)
  Top 0.152: v64.25,36.65 57.75,36.65 55,33.9 34.5,33.9 33.75,33.15 33.75,32.15 33,31.4 33,30.65 U$10.D12
  Bottom 0.152: v64.25,36.65 64.25,94.65 64.5,94.9 64.5,97.4 64.25,97.65 64.25,98.15 67.75,101.65 67.75,119.4 66.5,120.65 66.25,120.65 U$9.DIR

### Text on the board
tNames: ESP32 STEPPER BOARD V2.0 | Jelle Reith - December 2018 | jellereith.nl